# Altium schematic sheet ESP32.SchDoc
size A4; SheetNumber: 1; SheetTotal: 3
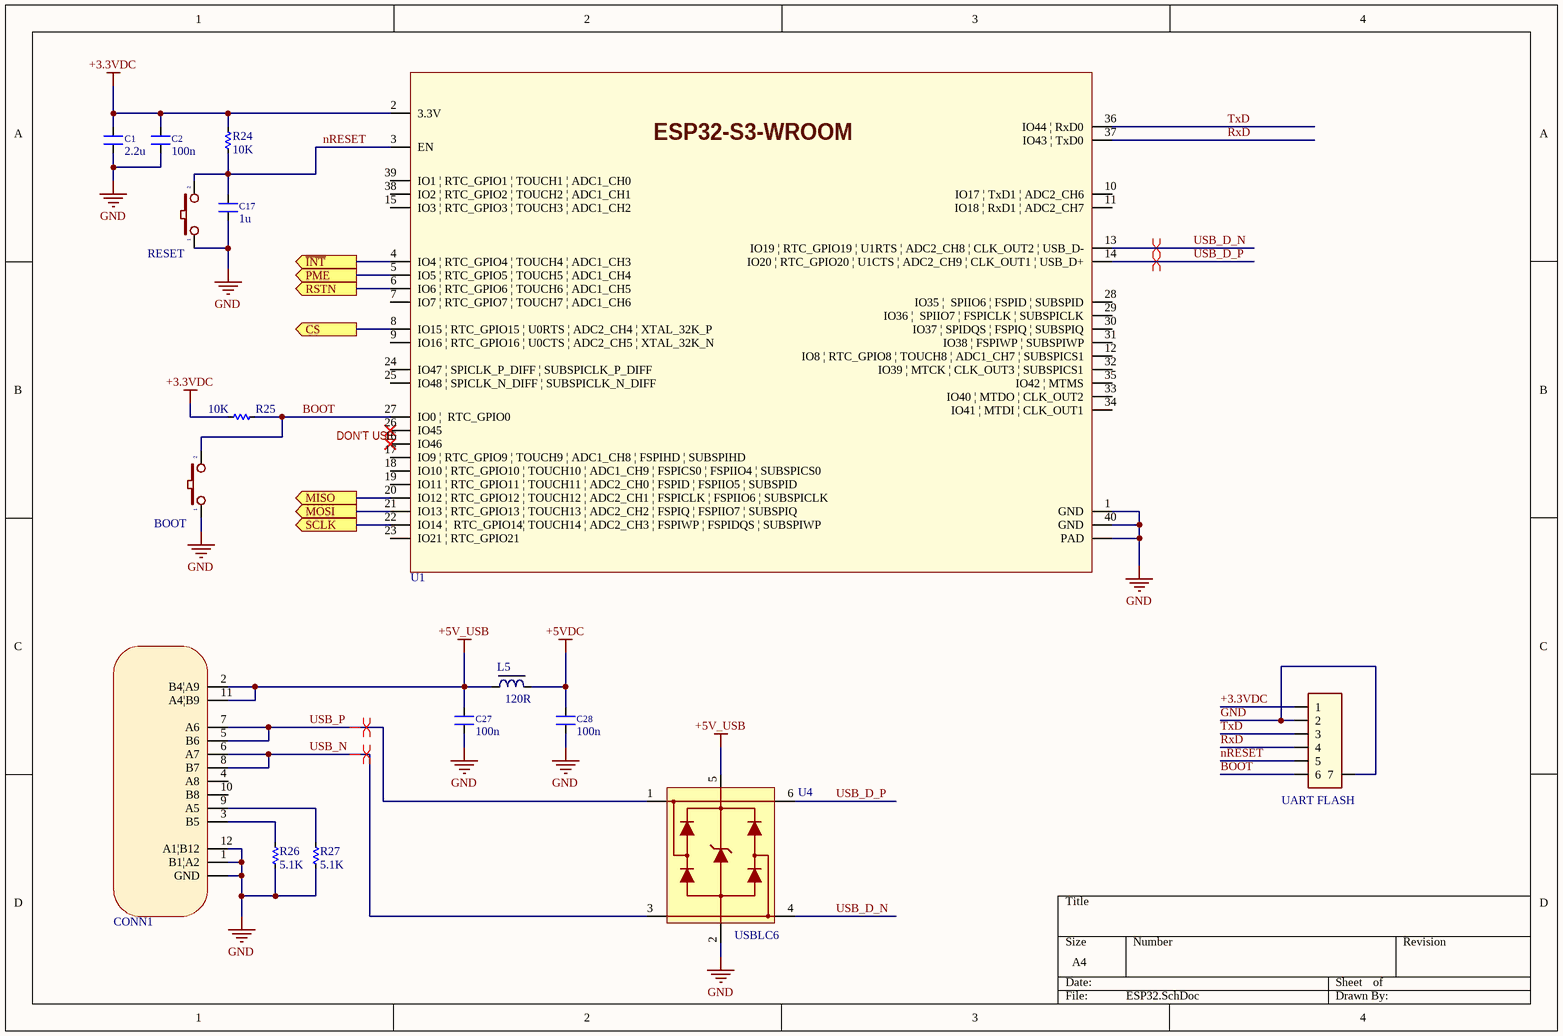
[diagram p0: ESP32.SchDoc]

## Parts
BOOT  BUTTON1  [SW-SMD - 3x4]  (value not drawn)
C1  2.2u  [CN-SMD-0805]
C2  100n  [CN-SMD-0603]
C17  1u  [CN-SMD-0603]
C27  100n  [CN-SMD-0603]
C28  100n  [CN-SMD-0603]
CONN1  USB-C3.1 12PIN  [TYPE-C-31-M-12]  (value not drawn)
L5  120R  [IN-SMD-0603]
R24  10K  [RES-SMD-0603]
R25  10K  [RES-SMD-0603]
R26  5.1K  [RES-SMD-0603]
R27  5.1K  [RES-SMD-0603]
RESET  BUTTON1  [SW-SMD - 3x4]  (value not drawn)
U1  ESP32 S3  [ESP32-S3-WROOM-1/1U]  (value not drawn)
U4  USBLC6  [SOT23-6]
UART_FLASH  CONNECTOR 6P  [JST-PH2.0_6P]  (value not drawn)

## Ports
CS (out), MISO (out), MOSI (out), PME (out), RSTN (out), SCLK (out), ~{INT} (out)

## Nets
+3.3VDC: C1.2 C2.2 R24.2 R25.2 U1.2(3.3V) UART_FLASH.1
+5V_USB: C27.2 CONN1.2(B4|A9) CONN1.11(A4|B9) L5.1 U4.5
+5VDC: C28.2 L5.2
GND: BOOT.1 C1.1 C2.1 C17.1 C27.1 C28.1 CONN1.1(B1|A2) CONN1.12(A1|B12) CONN1.GND R26.2 R27.2 RESET.1 U1.1(GND) U1.40(GND) U1.PAD U4.2 UART_FLASH.2 UART_FLASH.7
BOOT: BOOT.2 R25.1 U1.27(IO0_|__RTC_GPIO0) UART_FLASH.6
CS: U1.8(IO15_|_RTC_GPIO15_|_U0RTS_|_ADC2_CH4_|_XTAL_32K_P) ; port CS
~{INT}: U1.4(IO4_|_RTC_GPIO4_|_TOUCH4_|_ADC1_CH3) ; port ~{INT}
MISO: U1.20(IO12_|_RTC_GPIO12_|_TOUCH12_|_ADC2_CH1_|_FSPICLK_|_FSPIIO6_|_SUBSPICLK) ; port MISO
MOSI: U1.21(IO13_|_RTC_GPIO13_|_TOUCH13_|_ADC2_CH2_|_FSPIQ_|_FSPIIO7_|_SUBSPIQ) ; port MOSI
nRESET: C17.2 R24.1 RESET.2 U1.3(EN) UART_FLASH.5
PME: U1.5(IO5_|_RTC_GPIO5_|_TOUCH5_|_ADC1_CH4) ; port PME
RSTN: U1.6(IO6_|_RTC_GPIO6_|_TOUCH6_|_ADC1_CH5) ; port RSTN
RxD: U1.37(IO43_|_TxD0) UART_FLASH.4
SCLK: U1.22(IO14_|__RTC_GPIO14|_TOUCH14_|_ADC2_CH3_|_FSPIWP_|_FSPIDQS_|_SUBSPIWP) ; port SCLK
TxD: U1.36(IO44_|_RxD0) UART_FLASH.3
USB_D_N: U1.13(IO19_|_RTC_GPIO19_|_U1RTS_|_ADC2_CH8_|_CLK_OUT2_|_USB_D-) U4.4
USB_D_P: U1.14(IO20_|_RTC_GPIO20_|_U1CTS_|_ADC2_CH9_|_CLK_OUT1_|_USB_D+) U4.6
USB_N: CONN1.6(A7) CONN1.8(B7) U4.3
USB_P: CONN1.5(B6) CONN1.7(A6) U4.1
NetCONN1_3: CONN1.3(B5) R26.1
NetCONN1_9: CONN1.9(A5) R27.1

Not connected (* = marked no-connect by the designer): CONN1 4(A8) 10(B8); U1 7(IO7_|_RTC_GPIO7_|_TOUCH7_|_ADC1_CH6) 9(IO16_|_RTC_GPIO16_|_U0CTS_|_ADC2_CH5_|_XTAL_32K_N) 10(IO17_|_TxD1_|_ADC2_CH6) 11(IO18_|_RxD1_|_ADC2_CH7) 12(IO8_|_RTC_GPIO8_|_TOUCH8_|_ADC1_CH7_|_SUBSPICS1) 15(IO3_|_RTC_GPIO3_|_TOUCH3_|_ADC1_CH2) 16(IO46)* 17(IO9_|_RTC_GPIO9_|_TOUCH9_|_ADC1_CH8_|_FSPIHD_|_SUBSPIHD) 18(IO10_|_RTC_GPIO10_|_TOUCH10_|_ADC1_CH9_|_FSPICS0_|_FSPIIO4_|_SUBSPICS0) 19(IO11_|_RTC_GPIO11_|_TOUCH11_|_ADC2_CH0_|_FSPID_|_FSPIIO5_|_SUBSPID) 23(IO21_|_RTC_GPIO21) 24(IO47_|_SPICLK_P_DIFF_|_SUBSPICLK_P_DIFF) 25(IO48_|_SPICLK_N_DIFF_|_SUBSPICLK_N_DIFF) 26(IO45)* 28(IO35_|__SPIIO6_|_FSPID_|_SUBSPID) 29(IO36_|__SPIIO7_|_FSPICLK_|_SUBSPICLK) 30(IO37_|_SPIDQS_|_FSPIQ_|_SUBSPIQ) 31(IO38_|_FSPIWP_|_SUBSPIWP) 32(IO39_|_MTCK_|_CLK_OUT3_|_SUBSPICS1) 33(IO40_|_MTDO_|_CLK_OUT2) 34(IO41_|_MTDI_|_CLK_OUT1) 35(IO42_|_MTMS) 38(IO2_|_RTC_GPIO2_|_TOUCH2_|_ADC1_CH1) 39(IO1_|_RTC_GPIO1_|_TOUCH1_|_ADC1_CH0)

## Layout directives
differential pair: USB_D_N, USB_D_P, USB_N, USB_P

## Notes on the sheet
- (near U1) DON'T USE
- (in symbol ESP32 S3) ESP32-S3-WROOM

## Library data of the parts
BOOT RESET = BUTTON1: Value: 1N4007
C1 C2 C17 C27 C28 = CAP SMD: Value: 0,1uF/300V; Designed by: VanDungEvn
L5 = inductor-SMD: Value: 150 mH
R24-R27 = Res-SMD: Resistor; Manufacturer: Generic Components; Class: Passive; Published: 08/06/2000; Publisher: Altium Hobart Technology Centre
U1 = ESP32 S3: 2.4 GHz Wi-Fi (802.11 b/g/n) and Bluetooth® 5 (LE) module / Built around ESP32-S3 series of SoCs, Xtensa® dual-core 32-bit LX7 microprocessor / Flash up to 16 MB, PSRAM up to 16 MB / Up to 36 GPIOs, rich set of peripherals / On-board PCB antenna or external antenna connector
U4 = USBLC6: USB ESD